# Altium schematic sheet i2csensor.SchDoc
size A4; SheetNumber: 6; SheetTotal: 7
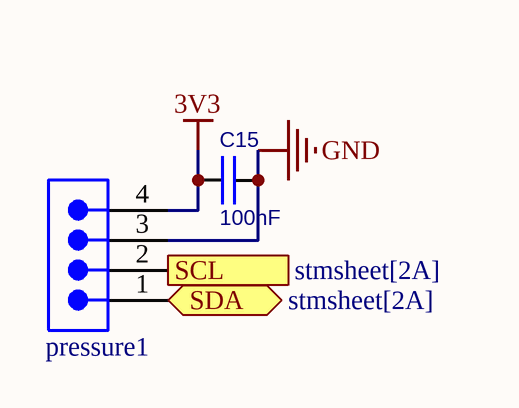
[diagram p0: i2csensor.SchDoc]

## Parts
C15  100nF  [C0603]
pressure1  COM&Heart  [691321100004]  (value not drawn)

## Ports
SCL (in, see stmsheet[2A]), SDA (bidir, see stmsheet[2A])

## Nets
3V3: C15.1 pressure1.4
GND: C15.2 pressure1.3
SCL: pressure1.2 ; port SCL
SDA: pressure1.1 ; port SDA

## Library data of the parts
C15 = C: Capacitor; Value: 100nF
pressure1 = CMP-1502-01785-2: NexarPartId: 18818342; Number of Contacts: 4; Voltage Rating: 300V; Current Rating: 10.5A; Number of Levels: 1; Gender: Male; Current: 10A; Pitch: 3.5052mm; Width: 18.6mm; Orientation: Vertical; Lead Pitch: 3.5mm; Voltage: 300V; Mount: Through Hole; Termination: Solder; Contact Material: Brass; Height: 9.4mm; Length: 7mm; RoHS: Compliant; Min Operating Temperature: -40°C; Number of Pins: 4; Max Operating Temperature: 105°C; REACH SVHC: Unknown; Packaging: Box; Number of Rows: 1; Number of Positions Per Level: 4; Lead Free: Lead Free; Color: Green